# Altium schematic sheet Microcontroller.SchDoc
size A3; SheetNumber: 1; SheetTotal: 3
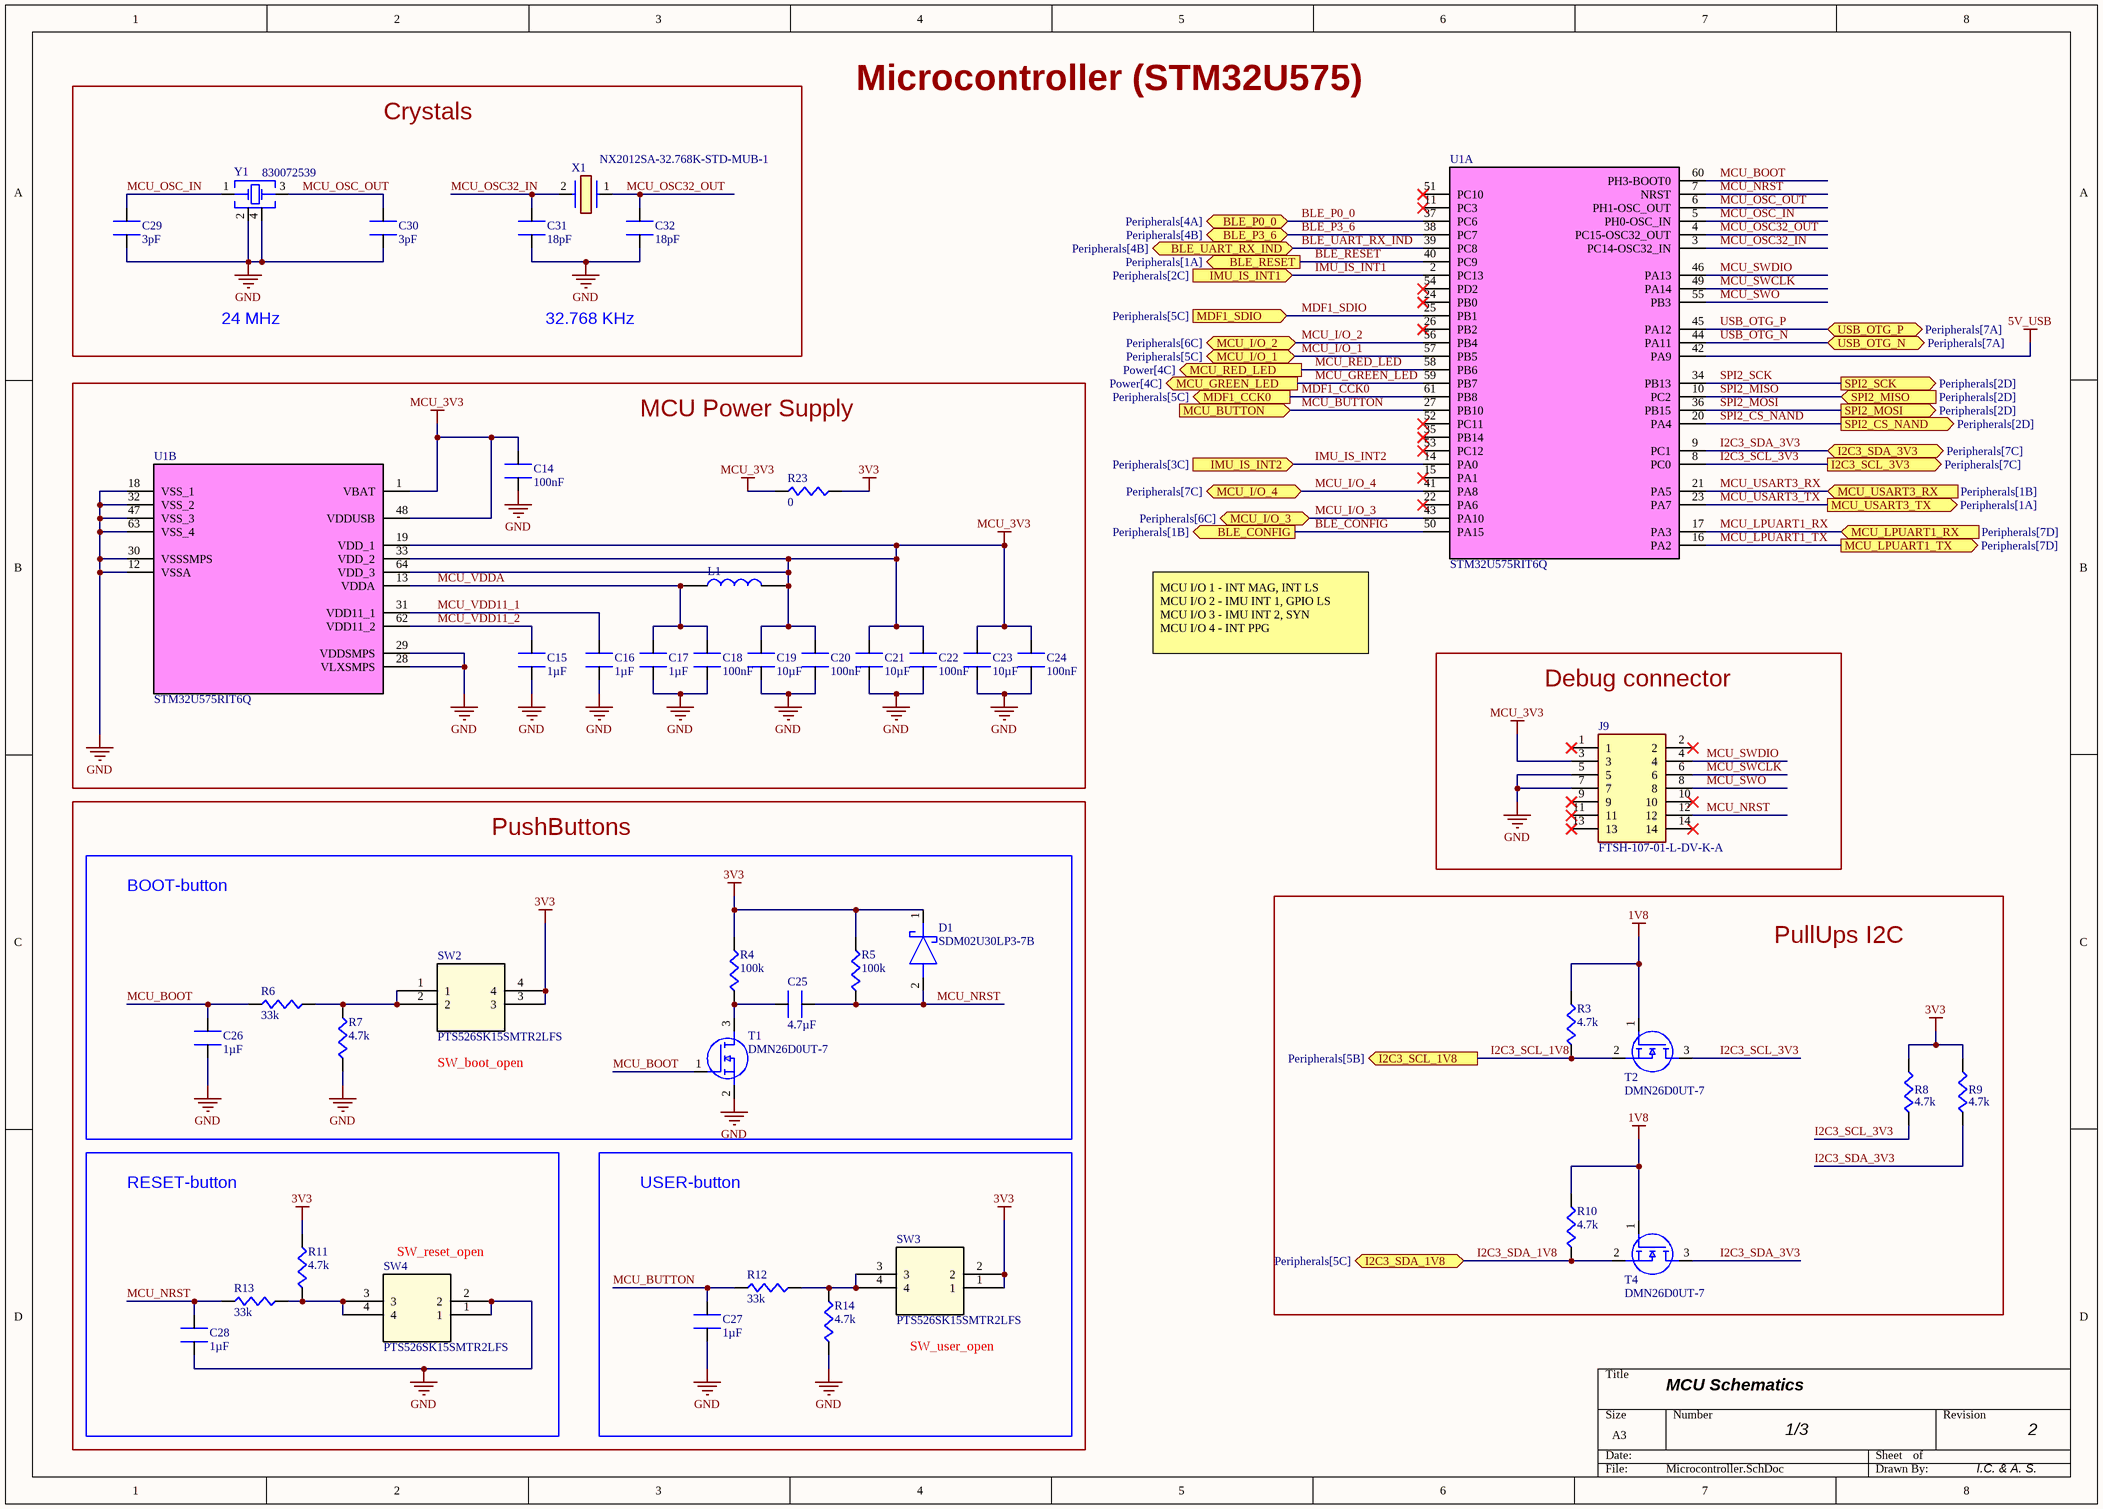
[diagram p0: Microcontroller.SchDoc]

## Parts
C14  value 100nF  [Chip2PinSM127P600-8N]  (hidden comment: 0402YC104JAT4A)
C15  value 1µF  [Chip2PinSM127P600-8N]  (hidden comment: TMK105BJ105MV-F)
C16  value 1µF  [Chip2PinSM127P600-8N]  (hidden comment: TMK105BJ105MV-F)
C17  value 1µF  [Chip2PinSM127P600-8N]  (hidden comment: TMK105BJ105MV-F)
C18  value 100nF  [Chip2PinSM127P600-8N]  (hidden comment: 0402YC104JAT4A)
C19  value 10µF  [Chip2PinSM127P600-8N]  (hidden comment: 0402ZD106MAT2A)
C20  value 100nF  [Chip2PinSM127P600-8N]  (hidden comment: 0402YC104JAT4A)
C21  value 10µF  [Chip2PinSM127P600-8N]  (hidden comment: 0402ZD106MAT2A)
C22  value 100nF  [Chip2PinSM127P600-8N]  (hidden comment: 0402YC104JAT4A)
C23  value 10µF  [Chip2PinSM127P600-8N]  (hidden comment: 0402ZD106MAT2A)
C24  value 100nF  [Chip2PinSM127P600-8N]  (hidden comment: 0402YC104JAT4A)
C25  value 4.7µF  [Chip2PinSM127P600-8N]  (hidden comment: 02016D475MAT2A)
C26  value 1µF  [Chip2PinSM127P600-8N]  (hidden comment: CL03A105KP3NSNC)
C27  value 1µF  [Chip2PinSM127P600-8N]  (hidden comment: CL03A105KP3NSNC)
C28  value 1µF  [Chip2PinSM127P600-8N]  (hidden comment: CL03A105KP3NSNC)
C29  value 3pF  [Chip2PinSM127P600-8N]  (hidden comment: C0402C309K4GACTU)
C30  value 3pF  [Chip2PinSM127P600-8N]  (hidden comment: C0402C309K4GACTU)
C31  value 18pF  [Chip2PinSM127P600-8N]  (hidden comment: GRM0335C1E180JA01D)
C32  value 18pF  [Chip2PinSM127P600-8N]  (hidden comment: GRM0335C1E180JA01D)
D1  SDM02U30LP3-7B  [SDM02U30LP3-7B-Footprint-1]
J9  FTSH-107-01-L-DV-K-A  [FTSH-107-01-L-DV-K-A-Footprint-1]
L1  PLEA67BBA2R2M-1PT00  [FP-PLEA67-MFG]  (value not drawn)
R3  value 4.7k  [Chip2PinSM127P600-8N]  (hidden comment: CR0201-JW-472GLF)
R4  value 100k  [Chip2PinSM127P600-8N]  (hidden comment: ERJ-1GNJ104C)
R5  value 100k  [Chip2PinSM127P600-8N]  (hidden comment: ERJ-1GNJ104C)
R6  value 33k  [Chip2PinSM127P600-8N]  (hidden comment: CR0201-FW-3302GLF)
R7  value 4.7k  [Chip2PinSM127P600-8N]  (hidden comment: CR0201-JW-472GLF)
R8  value 4.7k  [RESC1005X04N]  (hidden comment: CRCW04024K70FKED)
R9  value 4.7k  [RESC1005X04N]  (hidden comment: CRCW04024K70FKED)
R10  value 4.7k  [Chip2PinSM127P600-8N]  (hidden comment: CR0201-JW-472GLF)
R11  value 4.7k  [Chip2PinSM127P600-8N]  (hidden comment: CR0201-JW-472GLF)
R12  value 33k  [Chip2PinSM127P600-8N]  (hidden comment: CR0201-FW-3302GLF)
R13  value 33k  [Chip2PinSM127P600-8N]  (hidden comment: CR0201-FW-3302GLF)
R14  value 4.7k  [Chip2PinSM127P600-8N]  (hidden comment: CR0201-JW-472GLF)
R23  value 0  [Chip2PinSM127P600-8N]  (hidden comment: CRCW02010000Z0ED)
SW2  PTS526SK15SMTR2LFS  [PTS526SK15SMTR2LFS-Footprint-1]
SW3  PTS526SK15SMTR2LFS  [PTS526SK15SMTR2LFS-Footprint-1]
SW4  PTS526SK15SMTR2LFS  [PTS526SK15SMTR2LFS-Footprint-1]
T1  DMN26D0UT-7  [DMN26D0UT-7-Footprint-1]
T2  DMN26D0UT-7  [DMN26D0UT-7-Footprint-1]
T4  DMN26D0UT-7  [DMN26D0UT-7-Footprint-1]
U1  STM32U575RIT6Q  [STM32U575RIT6Q-Footprint-1]  (parts A,B of 2)
X1  NX2012SA-32.768K-STD-MUB-1  [NX2012SA-32.768K-STD-MUB-1-Footprint-1]
Y1  830072539  [830072539-Footprint-1]

## Blocks framed on the sheet
Crystals: C29-C32 X1 Y1
MCU Power Supply: C14-C24 L1 R23 U1
Debug connector: J9
PushButtons: C25 C26 D1 R4-R7 SW2 T1
PullUps I2C: R3 R8-R10 T2 T4
RESET-button: C28 R11 R13 SW4
USER-button: C27 R12 R14 SW3

## Ports
BLE_CONFIG (out, see Peripherals[1B]), BLE_P0_0 (bidir, see Peripherals[4A]), BLE_P3_6 (bidir, see Peripherals[4B]), BLE_RESET (out, see Peripherals[1A]), BLE_UART_RX_IND (bidir, see Peripherals[4B]), I2C3_SCL_1V8 (out, see Peripherals[5B]), I2C3_SCL_3V3 (out, see Peripherals[7C]), I2C3_SDA_1V8 (bidir, see Peripherals[5C]), I2C3_SDA_3V3 (bidir, see Peripherals[7C]), IMU_IS_INT1 (in, see Peripherals[2C]), IMU_IS_INT2 (in, see Peripherals[3C]), MCU_BUTTON (in), MCU_GREEN_LED (out, see Power[4C]), MCU_I/O_1 (bidir, see Peripherals[5C]), MCU_I/O_2 (bidir, see Peripherals[6C]), MCU_I/O_3 (bidir, see Peripherals[6C]), MCU_I/O_4 (bidir, see Peripherals[7C]), MCU_LPUART1_RX (in, see Peripherals[7D]), MCU_LPUART1_TX (out, see Peripherals[7D]), MCU_RED_LED (out, see Power[4C]), MCU_USART3_RX (in, see Peripherals[1B]), MCU_USART3_TX (out, see Peripherals[1A]), MDF1_CCK0 (out, see Peripherals[5C]), MDF1_SDIO (in, see Peripherals[5C]), SPI2_CS_NAND (out, see Peripherals[2D]), SPI2_MISO (in, see Peripherals[2D]), SPI2_MOSI (out, see Peripherals[2D]), SPI2_SCK (out, see Peripherals[2D]), USB_OTG_N (bidir, see Peripherals[7A]), USB_OTG_P (bidir, see Peripherals[7A])

## Nets
1V8: R3.2 R10.2 T2.1(G) T4.1(G)
3V3: D1.1(K) R4.2 R5.2 R8.2 R9.2 R11.2 R23.2 SW2.3 SW2.4 SW3.1 SW3.2
5V_USB: U1.42(PA9)
GND: C14.1 C15.1 C16.1 C17.1 C18.1 C19.1 C20.1 C21.1 C22.1 C23.1 C24.1 C26.1 C27.1 C28.1 C29.1 C30.1 C31.1 C32.1 J9.5 J9.7 R7.1 R14.1 SW4.1 SW4.2 T1.2(S) U1.12(VSSA) U1.18(VSS_1) U1.28(VLXSMPS) U1.29(VDDSMPS) U1.30(VSSSMPS) U1.32(VSS_2) U1.47(VSS_3) U1.63(VSS_4) Y1.2(GND) Y1.4(GND)
MCU_3V3: C14.2 C19.2 C20.2 C21.2 C22.2 C23.2 C24.2 J9.3 L1.2 R23.1 U1.1(VBAT) U1.19(VDD_1) U1.33(VDD_2) U1.48(VDDUSB) U1.64(VDD_3)
BLE_CONFIG: U1.50(PA15) ; port BLE_CONFIG
BLE_P0_0: U1.37(PC6) ; port BLE_P0_0
BLE_P3_6: U1.38(PC7) ; port BLE_P3_6
BLE_RESET: U1.40(PC9) ; port BLE_RESET
BLE_UART_RX_IND: U1.39(PC8) ; port BLE_UART_RX_IND
I2C3_SCL_1V8: R3.1 T2.2(S) ; port I2C3_SCL_1V8
I2C3_SCL_3V3: R8.1 T2.3(D) U1.8(PC0) ; port I2C3_SCL_3V3
I2C3_SDA_1V8: R10.1 T4.2(S) ; port I2C3_SDA_1V8
I2C3_SDA_3V3: R9.1 T4.3(D) U1.9(PC1) ; port I2C3_SDA_3V3
IMU_IS_INT1: U1.2(PC13) ; port IMU_IS_INT1
IMU_IS_INT2: U1.14(PA0) ; port IMU_IS_INT2
MCU_BOOT: C26.2 R6.1 T1.1(G) U1.60(PH3-BOOT0)
MCU_BUTTON: C27.2 R12.1 U1.27(PB10) ; port MCU_BUTTON
MCU_GREEN_LED: U1.59(PB7) ; port MCU_GREEN_LED
MCU_I/O_1: U1.57(PB5) ; port MCU_I/O_1
MCU_I/O_2: U1.56(PB4) ; port MCU_I/O_2
MCU_I/O_3: U1.43(PA10) ; port MCU_I/O_3
MCU_I/O_4: U1.41(PA8) ; port MCU_I/O_4
MCU_LPUART1_RX: U1.17(PA3) ; port MCU_LPUART1_RX
MCU_LPUART1_TX: U1.16(PA2) ; port MCU_LPUART1_TX
MCU_NRST: C25.2 C28.2 D1.2(A) J9.12 R5.1 R13.1 U1.7(NRST)
MCU_OSC32_IN: C31.2 U1.3(PC14-OSC32_IN) X1.2(CRYSTAL_2)
MCU_OSC32_OUT: C32.2 U1.4(PC15-OSC32_OUT) X1.1(CRYSTAL_1)
MCU_OSC_IN: C29.2 U1.5(PH0-OSC_IN) Y1.1(Crystal)
MCU_OSC_OUT: C30.2 U1.6(PH1-OSC_OUT) Y1.3(Crystal)
MCU_RED_LED: U1.58(PB6) ; port MCU_RED_LED
MCU_SWCLK: J9.6 U1.49(PA14)
MCU_SWDIO: J9.4 U1.46(PA13)
MCU_SWO: J9.8 U1.55(PB3)
MCU_USART3_RX: U1.21(PA5) ; port MCU_USART3_RX
MCU_USART3_TX: U1.23(PA7) ; port MCU_USART3_TX
MCU_VDD11_1: C16.2 U1.31(VDD11_1)
MCU_VDD11_2: C15.2 U1.62(VDD11_2)
MCU_VDDA: C17.2 C18.2 L1.1 U1.13(VDDA)
MDF1_CCK0: U1.61(PB8) ; port MDF1_CCK0
MDF1_SDIO: U1.25(PB1) ; port MDF1_SDIO
SPI2_CS_NAND: U1.20(PA4) ; port SPI2_CS_NAND
SPI2_MISO: U1.10(PC2) ; port SPI2_MISO
SPI2_MOSI: U1.36(PB15) ; port SPI2_MOSI
SPI2_SCK: U1.34(PB13) ; port SPI2_SCK
USB_OTG_N: U1.44(PA11) ; port USB_OTG_N
USB_OTG_P: U1.45(PA12) ; port USB_OTG_P
NetC25_1: C25.1 R4.1 T1.3(D)
NetR6_2: R6.2 R7.2 SW2.1 SW2.2
NetR11_1: R11.1 R13.2 SW4.3 SW4.4
NetR12_2: R12.2 R14.2 SW3.3 SW3.4

Not connected (* = marked no-connect by the designer): J9 1* 2* 9* 10* 11* 13* 14*; U1 11(PC3)* 15(PA1)* 22(PA6)* 24(PB0)* 26(PB2)* 35(PB14)* 51(PC10)* 52(PC11)* 53(PC12)* 54(PD2)*

## Notes on the sheet
- Microcontroller (STM32U575)
- 24 MHz
- 32.768 KHz
- MCU I/O 1 - INT MAG, INT LS
  MCU I/O 2 - IMU INT 1, GPIO LS
  MCU I/O 3 - IMU INT 2, SYN
  MCU I/O 4 - INT PPG
- BOOT-button
- (near SW2) SW_boot_open
- (near SW4) SW_reset_open
- SW_user_open
- MCU Schematics
- 1/3
- 2
- I.C. & A. S.

## Library data of the parts
C14 C18 C20 C22 C24 = CMP-00047-1: Ceramic Capacitor, Multilayer, Ceramic, 16V, 5% +Tol, 5% -Tol, X7R, 15% TC, 0.1uF, Surface Mount, 0402; Multilayer: Yes; Rated DC Voltage (URdc): 16V; Tolerance  (fill in as +-): 5%; Dielectric Material: Ceramic; Reach SVHC Compliant: Yes; Package Style: SMTMeter; Mounting Technology: Surface Mount; Length: 1mm; Termination: Wraparound; Min Operating Temperature: -55°C; Width: 0.5mm; Tolerance (fill in as +-): 5%; Case/Package: 0402; Capacitor Type: Ceramic; RoHS Compliant: Yes; JESD-609 Code: e3; Max Operating Temperature: 125°C; Height: 0.56mm; Pins: 2; Package Shape: Rectangular; Packaging: Tape and Reel; Temperature Characteristics Code: X7R; Terminal Finish: Nickel
C15-C17 = CMP-001-00125-1: Ceramic Capacitor, Multilayer, Ceramic, 25V, 20% +Tol, 20% -Tol, X5R, 15% TC, 1uF, Surface Mount, 0402; Case/Package: 0402; Capacitor Type: Ceramic; Mounting Technology: Surface Mount; Pins: 2; Max Operating Temperature: 85°C; RoHS Compliant: Yes; Min Operating Temperature: -55°C
C19 C21 C23 = CMP-001-00089-10: Multilayer Ceramic Chip Capacitor 0402 Size 10uF 10V X5R ±20% Tolerance SMD T/R
C25 = CMP-001-00098-5: Condensatori in ceramica multistrato MLCC - SMD/SMT 6.3V 4.7uF X5R 0201 20%; RoHS Compliant: Yes; Tolerance: 20%; Min Operating Temperature: -55°C; Max Operating Temperature: 85°C; Mounting Technology: Surface Mount
C26-C28 = CMP-001-00095-4: Ceramic Capacitor, Multilayer, Ceramic, 10V, 10% +Tol, 10% -Tol, X5R, 15% TC, 1uF, Surface Mount, 0201; Min Operating Temperature: -55°C; Capacitor Type: Ceramic; Pins: 2; Max Operating Temperature: 85°C; Mounting Technology: Surface Mount; Case/Package: 0201; RoHS Compliant: Yes
C29 C30 = CMP-001-00094-8: Cap Cer 3PF 16V NP0 0402; Tolerance: 10%; Case/Package: 0402; Max Operating Temperature: 125°C; Voltage Rating: 16V; Mounting Technology: Surface Mount; Min Operating Temperature: -55°C; RoHS Compliant: Yes
C31 C32 = CMP-001-00124-2: Ceramic Capacitor, Multilayer, Ceramic, 25V, 5% +Tol, 5% -Tol, C0G, 30ppm/Cel TC, 0.000018uF, Surface Mount, 0201; Capacitor Type: Ceramic; Mounting Technology: Surface Mount; Pins: 2; Max Operating Temperature: 125°C; RoHS Compliant: Yes; Case/Package: 0201; Min Operating Temperature: -55°C
D1 = CMP-004-00034-3: Rectifier Diode, Schottky, 1 Phase, 1 Element, 0.1A, 30V V(RRM), Silicon; Forward Voltage: 370mV; RoHS Compliant: Yes; Max Operating Temperature: 150°C; Pins: 2; Min Operating Temperature: -65°C
J9 = CMP-002-00103-2: Board Connector; Connector Type: BOARD CONNECTOR; RoHS Compliant: Yes
L1 = CMP-006-00037-1: Power Inductors - SMD 2.2uH 20% 620mOhm 0.5A
R3 R7 R10 R11 R14 = CMP-00117-1: Fixed Resistor, Metal Glaze/thick Film, 0.05W, 4700ohm, 30V, 5% +/-Tol, 200ppm/Cel, Surface Mount, 0201; Temperature Coefficient: 200ppm/°C; Working Voltage: 25V; Rated Temperature: 70°C; Package Height: 0.23mm; Power: 50mW; Package Width: 0.3mm; Package Length: 0.6mm; Max Operating Temperature: 125°C; Construction: Chip; Technology: RUTHENIUM OXIDE; Min Operating Temperature: -55°C; Terminal Finish: Nickel; Packaging: Tape and Reel; Pins: 2; Tolerance: 5%; Termination: Wraparound; Package Style: SMTMeter; Reach SVHC Compliant: Yes; Mounting Technology: Surface Mount; Package Shape: Rectangular; JESD-609 Code: e3; Case/Package: 0201; Resistor Type: FIXED RESISTOR; RoHS Compliant: Yes
R4 R5 = CMP-009-00199-1: Fixed Resistor, Metal Glaze/thick Film, 0.05W, 100000ohm, 25V, 5% +/-Tol, 200ppm/Cel, Surface Mount, 0201; Power: 50mW; Min Operating Temperature: -55°C; Max Operating Temperature: 125°C; RoHS Compliant: Yes; Pins: 2; Case/Package: 0201; Mounting Technology: Surface Mount; Tolerance: 5%
R6 R12 R13 = CMP-00128-1: Fixed Resistor, Metal Glaze/thick Film, 0.05W, 33000ohm, 30V, 1% +/-Tol, 200ppm/Cel, Surface Mount, 0201; Package Width: 0.3mm; Power: 50mW; Working Voltage: 25V; Package Length: 0.6mm; Temperature Coefficient: 200ppm/°C; Package Height: 0.23mm; Rated Temperature: 70°C; Tolerance: 1%; Pins: 2; Termination: Wraparound; JESD-609 Code: e3; Package Shape: Rectangular; Min Operating Temperature: -55°C; Case/Package: 0201; RoHS Compliant: Yes; Packaging: Tape and Reel; Terminal Finish: Nickel; Max Operating Temperature: 125°C; Mounting Technology: Surface Mount; Construction: Chip; Reach SVHC Compliant: Yes; Package Style: SMTMeter; Resistor Type: FIXED RESISTOR; Technology: RUTHENIUM OXIDE
R8 R9 = CMP-009-00183-1: SMD Chip Resistor, 4.7 kOhm, ± 1%, 63 mW, 0402 [1005 Metric], Thick Film, General Purpose
R23 = CMP-00081-1: Fixed Resistor, Metal Glaze/thick Film, 0.05W, 0ohm, Surface Mount, 0201; Package Length: 0.6mm; Power: 50mW; Rated Temperature: 70°C; Package Width: 0.3mm; Package Height: 0.23mm; Reference Standard: AEC-Q200; Terminal Finish: Nickel; Pins: 2; Package Shape: Rectangular; Resistor Type: FIXED RESISTOR; Max Operating Temperature: 155°C; Min Operating Temperature: -55°C; JESD-609 Code: e3; Mounting Technology: Surface Mount; Termination: Wraparound; Package Style: SMTMeter; RoHS Compliant: Yes; Case/Package: 0201; Construction: Chip; Reach SVHC Compliant: Yes; Technology: METAL GLAZE/THICK FILM; Packaging: Tape and Reel
SW2-SW4 = CMP-011-00019-2: Switch Tactile N.O. SPST Round Button Gull Wing 0.05A 12VDC 200000Cycles 2.45N SMD T/R
T1 T2 T4 = CMP-013-00038-1: Small Signal Field-Effect Transistor, 0.23A I(D), 20V, 1-Element, N-Channel, Silicon, Metal-oxide Semiconductor FET; Max Operating Temperature: 150°C; Pins: 3; RoHS Compliant: Yes
U1 = CMP-020-00027-5: Ultra-low-power with FPU Arm Cortex-M33 MCU with TrustZone, 160 MHz with 2 Mbytes of Flash memory
X1 = CMP-00100-3: Parallel - Fundamental Quartz Crystal, 0.032768MHz Nom; Load Capacitance: 12.5pF; Drive Level: 0.1uW; ESR: 80k; Frequency Tolerance: 20ppm; Frequency Stability: 0.0144%; Crystal/Resonator Type: PARALLEL - FUNDAMENTAL; Max Operating Temperature: 85°C; Mounting Technology: Surface Mount; Manufacturer Series: NX2012SA; Min Operating Temperature: -40°C; Operating Frequency-Nom: 0.032768; RoHS Compliant: Yes; Reach SVHC Compliant: Yes
Y1 = CMP-003-00032-4: Cristalli WE-XTAL 24.0MHz 15ppm 1.6 x 1.2mm